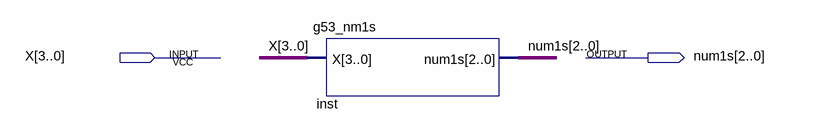
[diagram p0: schematic sheet]
// Quartus schematic G53_sum1s.bdf as structural Verilog: 1 symbols, 2 pins
module G53_sum1s (
  input  [3:0] X,
  output [2:0] num1s
);

  g53_nm1s inst (.X(X), .num1s(num1s));
endmodule
